# Altium schematic sheet FLIP_FLOP.SchDoc
size A4; SheetNumber: 1; SheetTotal: 1
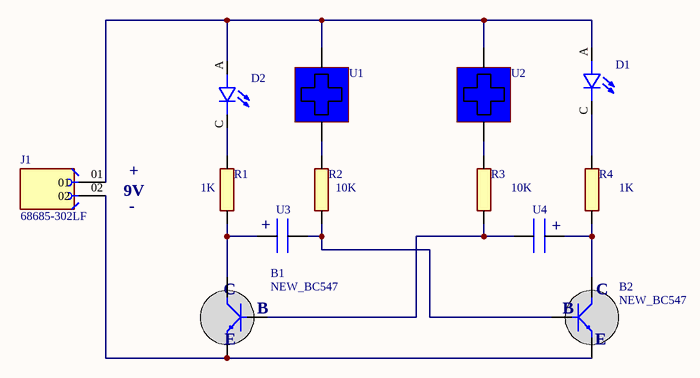
[diagram p0: FLIP_FLOP.SchDoc]

## Parts
B1  NEW_BC547  [NEW_BC547]
B2  NEW_BC547  [NEW_BC547]
D1  L08R5000Q1  [LEDRD254W57D500H1070]  (value not drawn)
D2  L08R5000Q1  [LEDRD254W57D500H1070]  (value not drawn)
J1  68685-302LF  [AMPHENOL_68685-302LF]
R1  VERTICAL RESISTOR  [VERTICAL_RESISTOR]  (value not drawn)
R2  VERTICAL RESISTOR  [VERTICAL_RESISTOR]  (value not drawn)
R3  VERTICAL RESISTOR  [VERTICAL_RESISTOR]  (value not drawn)
R4  VERTICAL RESISTOR  [VERTICAL_RESISTOR]  (value not drawn)
U1  220K TRIMPOT  [220K_TRIMPOT]  (value not drawn)
U2  220K TRIMPOT  [220K_TRIMPOT]  (value not drawn)
U3  10uF CAPACITOR  [10uF_CAPACITOR]  (value not drawn)
U4  10uF CAPACITOR  [10uF_CAPACITOR]  (value not drawn)

## Nets
NetB1_0: B1.0 R1.0 U3.0
NetB1_1: B1.1 R3.0 U4.0
NetB1_2: B1.2 B2.2 J1.02
NetB2_0: B2.0 R4.0 U4.1
NetB2_1: B2.1 R2.0 U3.1
NetD1_A: D1.A D2.A J1.01 U1.1 U2.1
NetD1_C: D1.C R4.1
NetD2_C: D2.C R1.1
NetR2_1: R2.1 U1.0
NetR3_1: R3.1 U2.0

## Notes on the sheet
- (near J1) 9V
- (near J1) +
- (near J1) -
- (near R1) 1K
- (near R2) 10K
- 10K
- (near R4) 1K
- (near U3) +
- (near U4) +
- (in symbol NEW_BC547) C; B; E

## Library data of the parts
B1 B2 = NEW_BC547: BC547
D1 D2 = L08R5000Q1: LED, 5MM, ORANGE; LED / Lamp Size: 5mm / T-1 3/4; LED Colour: Orange; Typ Luminous Intensity: 4.3mcd; Viewing Angle: ...; MF: LED Technology; Value: *; SnapEDA_Link: https://www.snapeda.com/parts/L08R5000Q1/LED+Technology/view-part/?ref=snap; MP: L08R5000Q1; Check_prices: https://www.snapeda.com/parts/L08R5000Q1/LED+Technology/view-part/?ref=eda; Availability: In Stock; Price: None; Package: None
J1 = 68685-302LF: DuboxÂ®, Board to Board connector, PCB Mounted Receptacle, Vertical, Through Hole, Top Entry, Single Row, 2 positions, 2.54mm (0.100in) Pitch.; MF: Amphenol ICC (FCI); Digi-Key_Part_Number: 609-68685-302LF-ND; Package: None; Purchase-URL: https://pricing.snapeda.com/search/part/68685-302LF/?ref=eda; MP: 68685-302LF; Check_prices: https://www.snapeda.com/parts/68685-302LF/Amphenol+FCI/view-part/?ref=eda; Value: *; SnapEDA_Link: https://www.snapeda.com/parts/68685-302LF/Amphenol+FCI/view-part/?ref=snap
U1 U2 = 220K TRIMPOT: vertical trimpot